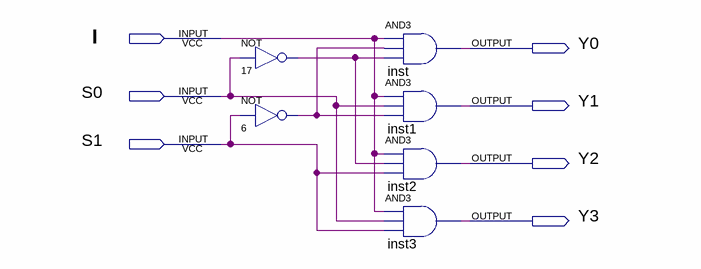
[diagram p0: schematic sheet]
// Quartus schematic 1x4_Demux.bdf as structural Verilog: 6 symbols, 7 pins
module \1x4_Demux  (
  input  I,
  input  S0,
  input  S1,
  output Y0,
  output Y1,
  output Y2,
  output Y3
);

  wire n6_out, n17_out;

  not u_17 (n17_out, S0);
  not u_6 (n6_out, S1);
  and inst (Y0, I, n6_out, n17_out);
  and inst1 (Y1, I, S0, n6_out);
  and inst2 (Y2, I, n17_out, S1);
  and inst3 (Y3, I, S0, S1);
endmodule
